# EAGLE schematic Simple Inverter Circuit (EAGLE 9.6.2)
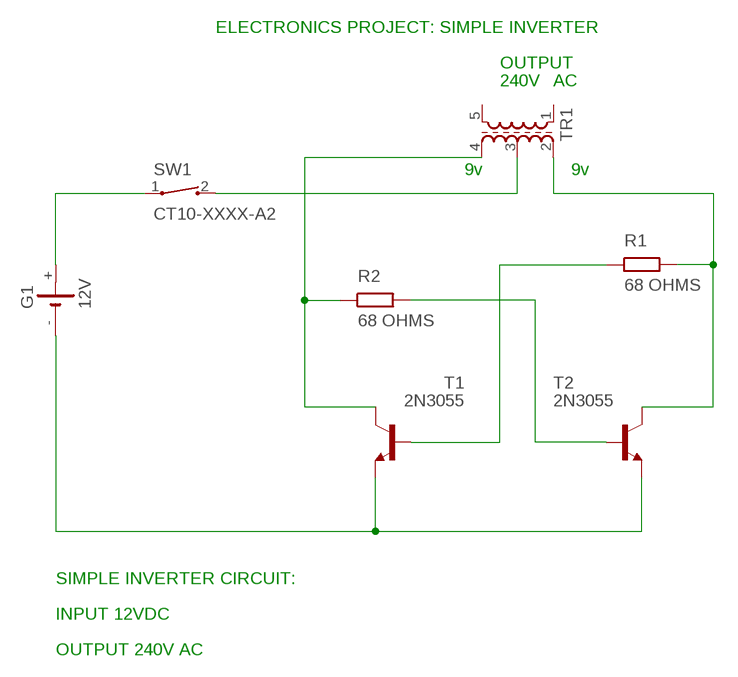
[diagram p0: schematic, sheet 1]

## Parts
G1  12V  CH291-1220LF  [CH291-1220LF]
R1  68 OHMS  R  (no package)
R2  68 OHMS  R  (no package)
SW1  CT10-XXXX-A2  [CT10-XXXX-A2]
T1  2N3055  [TO3]
T2  2N3055  [TO3]
TR1  SM-T4-2T  [SM-T4]

## Nets
N$1: G1.+ SW1.1
N$2: G1.- T1.E T2.E
N$3: R1.1 T1.B
N$4: R1.2 T2.C T2.C/(C) TR1.2
N$5: SW1.2 TR1.3
N$6: R2.2 T2.B
N$7: R2.1 T1.C T1.C/(C) TR1.4
Unconnected: TR1.1 TR1.5

## Notes on the sheet
- ELECTRONICS PROJECT: SIMPLE INVERTER
- OUTPUT
- 240V | AC
- 9v | 9v
- SIMPLE INVERTER CIRCUIT:
- INPUT 12VDC
- OUTPUT 240V AC

## Library data of the parts
G1 = battery:CH291-1220LF: Battery Holder, SMT, 12mm multicomp PART NO. CH291-1220LF Source: Data sheet <http://www.farnell.com/datasheets/1505860.pdf>
R1 R2 = ngspice-simulation:R: RESISTOR
SW1 = switch-coto:CT10-XXXX-: CT10 Series Molded Switch Source: www.cotorelay.com .. Coto_Technology__CT10-1530-G1.pdf
T1 T2 = transistor:2N3055: NPN TRANSISTOR
TR1 = inductor-neosid:SM-T4-2T: TRANSFORMER SMD wideband transformer with tab; OC_FARNELL: unknown; OC_NEWARK: unknown